# EAGLE design FOURCHANNEL REAY DRIVER (EAGLE 6.5.0)
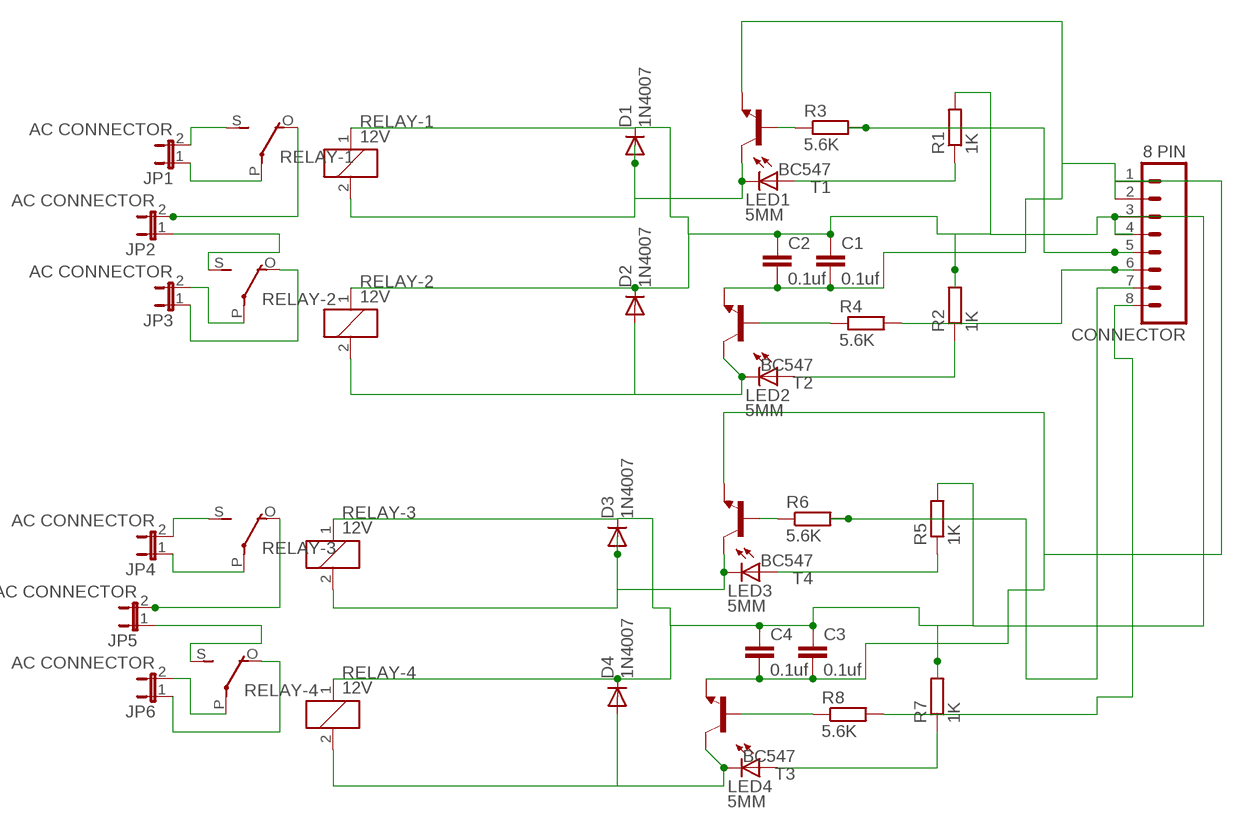
[diagram p0: schematic, sheet 1]

## Parts
C1  0.1uf  C2,5-3  [C2.5-3]
C2  0.1uf  C2,5-3  [C2.5-3]
C3  0.1uf  C2,5-3  [C2.5-3]
C4  0.1uf  C2,5-3  [C2.5-3]
CONNECTOR  8 PIN  M08  [08P]
D1  1N4007  1N4004  [DO41-10]
D2  1N4007  1N4004  [DO41-10]
D3  1N4007  1N4004  [DO41-10]
D4  1N4007  1N4004  [DO41-10]
JP1  AC CONNECTOR  JP1E  [JP1]
JP2  AC CONNECTOR  JP1E  [JP1]
JP3  AC CONNECTOR  JP1E  [JP1]
JP4  AC CONNECTOR  JP1E  [JP1]
JP5  AC CONNECTOR  JP1E  [JP1]
JP6  AC CONNECTOR  JP1E  [JP1]
LED1  5MM  LED5MM  [LED5MM]
LED2  5MM  LED5MM  [LED5MM]
LED3  5MM  LED5MM  [LED5MM]
LED4  5MM  LED5MM  [LED5MM]
R1  1K  R-EU_0204/7  [0204/7]
R2  1K  R-EU_0204/7  [0204/7]
R3  5.6K  R-EU_0204/7  [0204/7]
R4  5.6K  R-EU_0204/7  [0204/7]
R5  1K  R-EU_0204/7  [0204/7]
R6  5.6K  R-EU_0204/7  [0204/7]
R7  1K  R-EU_0204/7  [0204/7]
R8  5.6K  R-EU_0204/7  [0204/7]
RELAY-1  12V  G5L  [G5LE]
RELAY-2  12V  G5L  [G5LE]
RELAY-3  12V  G5L  [G5LE]
RELAY-4  12V  G5L  [G5LE]
T1  BC547  [TO92]
T2  BC547  [TO92]
T3  BC547  [TO92]
T4  BC547  [TO92]

## Nets
N$1: D1.A LED1.K(C) RELAY-1.2 T1.3(C)
N$3: D3.A LED3.K(C) RELAY-3.2 T4.3(C)
N$4: C1.1 C2.1 C3.1 C4.1 CONNECTOR.3 CONNECTOR.4 D1.C D2.C D3.C D4.C R1.2 R2.2 R5.2 R7.2 RELAY-1.1 RELAY-2.1 RELAY-3.1 RELAY-4.1
N$5: R4.1 T2.2(B)
N$6: R3.1 T1.2(B)
N$7: LED1.A R1.1
N$8: LED2.A R2.1
N$9: JP1.2 RELAY-1.S(2:S)
N$10: JP1.1 RELAY-1.P(2:P)
N$11: JP2.2 RELAY-1.O(2:O)
N$12: JP2.1 RELAY-2.S(2:S)
N$13: JP3.2 RELAY-2.P(2:P)
N$14: JP3.1 RELAY-2.O(2:O)
N$15: R8.1 T3.2(B)
N$17: CONNECTOR.5 R3.2
N$18: CONNECTOR.6 R4.2
N$19: R6.1 T4.2(B)
N$20: D2.A LED2.K(C) RELAY-2.2 T2.3(C)
N$21: LED3.A R5.1
N$22: LED4.A R7.1
N$23: JP4.2 RELAY-3.S(2:S)
N$24: JP4.1 RELAY-3.P(2:P)
N$25: JP5.2 RELAY-3.O(2:O)
N$26: JP5.1 RELAY-4.S(2:S)
N$27: JP6.2 RELAY-4.P(2:P)
N$28: JP6.1 RELAY-4.O(2:O)
N$29: C1.2 C2.2 C3.2 C4.2 CONNECTOR.1 CONNECTOR.2 T1.1(E) T2.1(E) T3.1(E) T4.1(E)
N$30: CONNECTOR.7 R6.2
N$31: CONNECTOR.8 R8.2
N$32: D4.A LED4.K(C) RELAY-4.2 T3.3(C)

## Library data of the parts
C1-C4 = capacitor-wima:C: CAPACITOR naming: grid - package width
CONNECTOR = con-amp-quick:M08: AMP QUICK CONNECTOR; OC_FARNELL: unknown; OC_NEWARK: unknown
D1-D4 = diode:1N4004: DIODE general purpose rectifier, 1 A
JP1-JP6 = jumper:JP1E: JUMPER
LED1-LED4 = led:LED: LED OSRAM: - CHIPLED LG R971, LG N971, LY N971, LG Q971, LY Q971, LO R971, LY R971 LH N974, LH R974 LS Q976, LO Q976, LY Q976 LO Q996 - Hyper CHIPLED LW Q18S LB Q993, LB Q99A, LB R99A - SideLED LS A670, LO A670, LY A670, LG A670, LP A670 LB A673, LV A673, LT A673, LW A673 LH A674 LY A675 LS A676, LA A676, LO A676, LY A676, LW A676 LS A679, LY A679, LG A679 - Hyper Micro SIDELED® LS Y876, LA Y876, LO Y876, LY Y876 LT Y87S - SmartLED LW L88C, LW L88S LB L89C, LB L89S, LG L890 LS L89K, LO L89K, LY L89K LS L896, LA L896, LO L896, LY L896 - TOPLED LS T670, LO T670, LY T670, LG T670, LP T670 LSG T670, LSP T670, LSY T670, LOP T670, LYG T670 LG T671, LOG T671, LSG T671 LB T673, LV T673, LT T673, LW T673 LH T674 LS T676, LA T676, LO T676, LY T676, LB T676, LH T676, LSB T676, LW T676 LB T67C, LV T67C, LT T67C, LS T67K, LO T67K, LY T67K, LW E67C LS E67B, LA E67B, LO E67B, LY E67B, LB E67C, LV E67C, LT E67C LW T67C LS T679, LY T679, LG T679 LS T770, LO T770, LY T770, LG T770, LP T770 LB T773, LV T773, LT T773, LW T773 LH T774 LS E675, LA E675, LY E675, LS T675 LS T776, LA T776, LO T776, LY T776, LB T776 LHGB T686 LT T68C, LB T68C - Hyper Mini TOPLED® LB M676 - Mini TOPLED Santana® LG M470 LS M47K, LO M47K, LY M47K Source: http://www.osram.convergy.de LUXEON: - LUMILED® LXK2-PW12-R00, LXK2-PW12-S00, LXK2-PW14-U00, LXK2-PW14-V00 LXK2-PM12-R00, LXK2-PM12-S00, LXK2-PM14-U00 LXK2-PE12-Q00, LXK2-PE12-R00, LXK2-PE12-S00, LXK2-PE14-T00, LXK2-PE14-U00 LXK2-PB12-K00, LXK2-PB12-L00, LXK2-PB12-M00, LXK2-PB14-N00, LXK2-PB14-P00, LXK2-PB14-Q00 LXK2-PR12-L00, LXK2-PR12-M00, LXK2-PR14-Q00, LXK2-PR14-R00 LXK2-PD12-Q00, LXK2-PD12-R00, LXK2-PD12-S00 LXK2-PH12-R00, LXK2-PH12-S00 LXK2-PL12-P00, LXK2-PL12-Q00, LXK2-PL12-R00 Source: www.luxeon.com KINGBRIGHT: KA-3528ASYC Source: www.kingbright.com
R1-R8 = rcl:R-EU_: RESISTOR, European symbol
RELAY-1-RELAY-4 = relay:G5L: RELAY 1 x switch, 10 A/120 V AC, 8 A/30 V ADC, Omron; OC_FARNELL: unknown; OC_NEWARK: unknown
T1-T4 = transistor:BC547: NPN TRANSISTOR

## Board
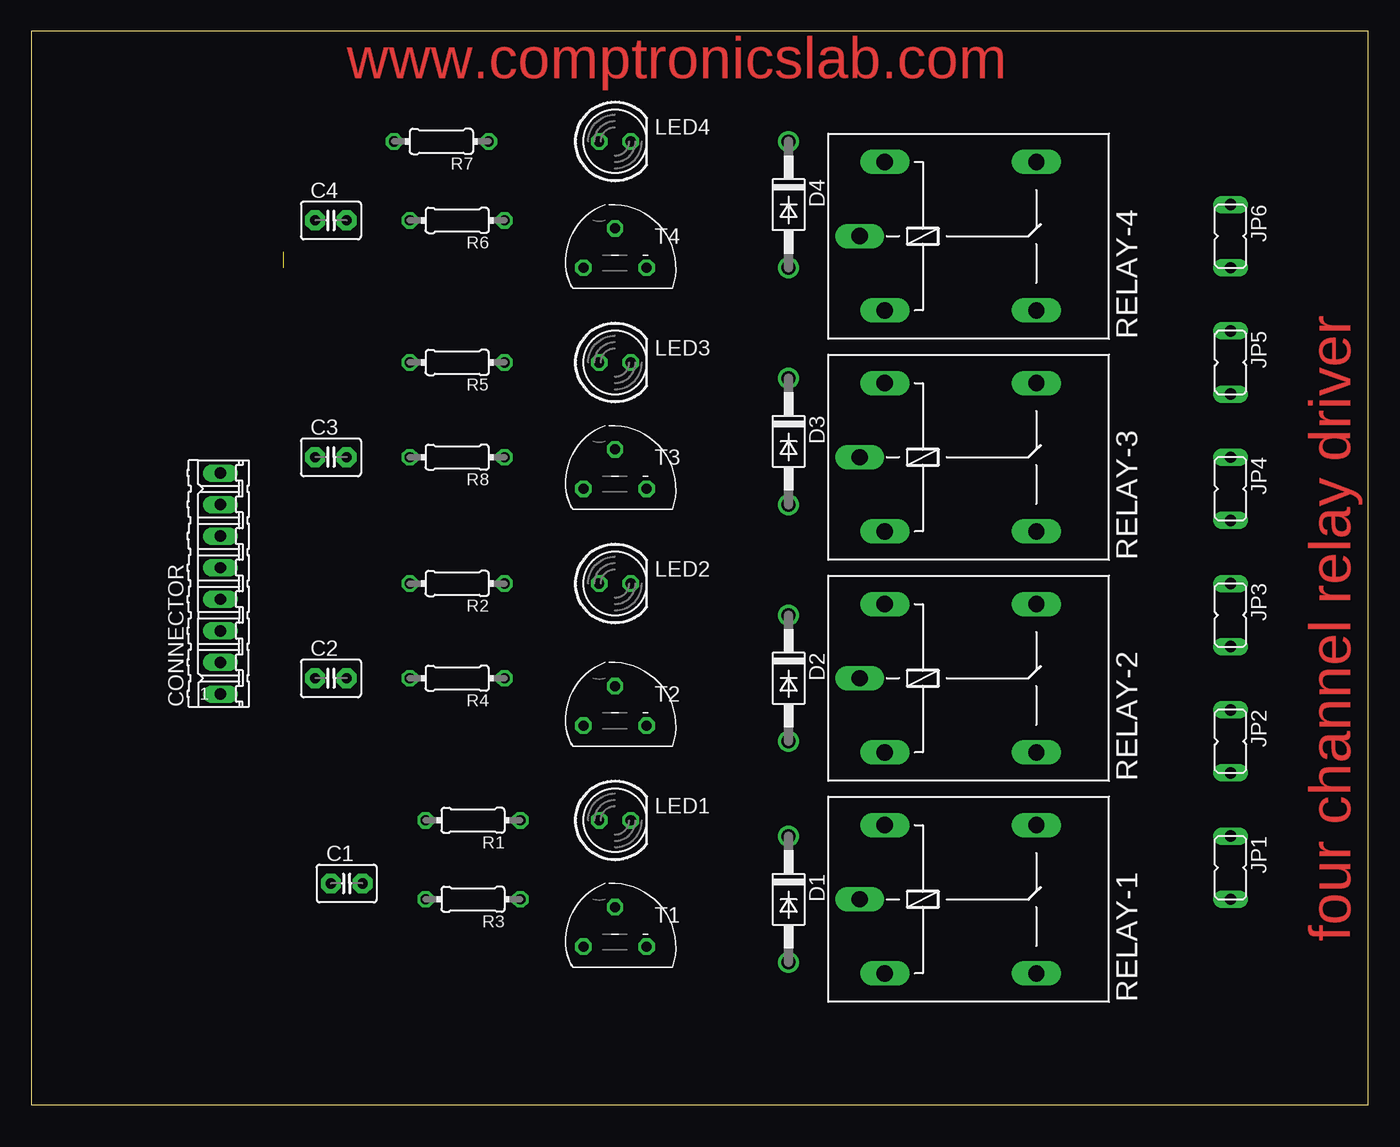
[diagram p1: board, top side]
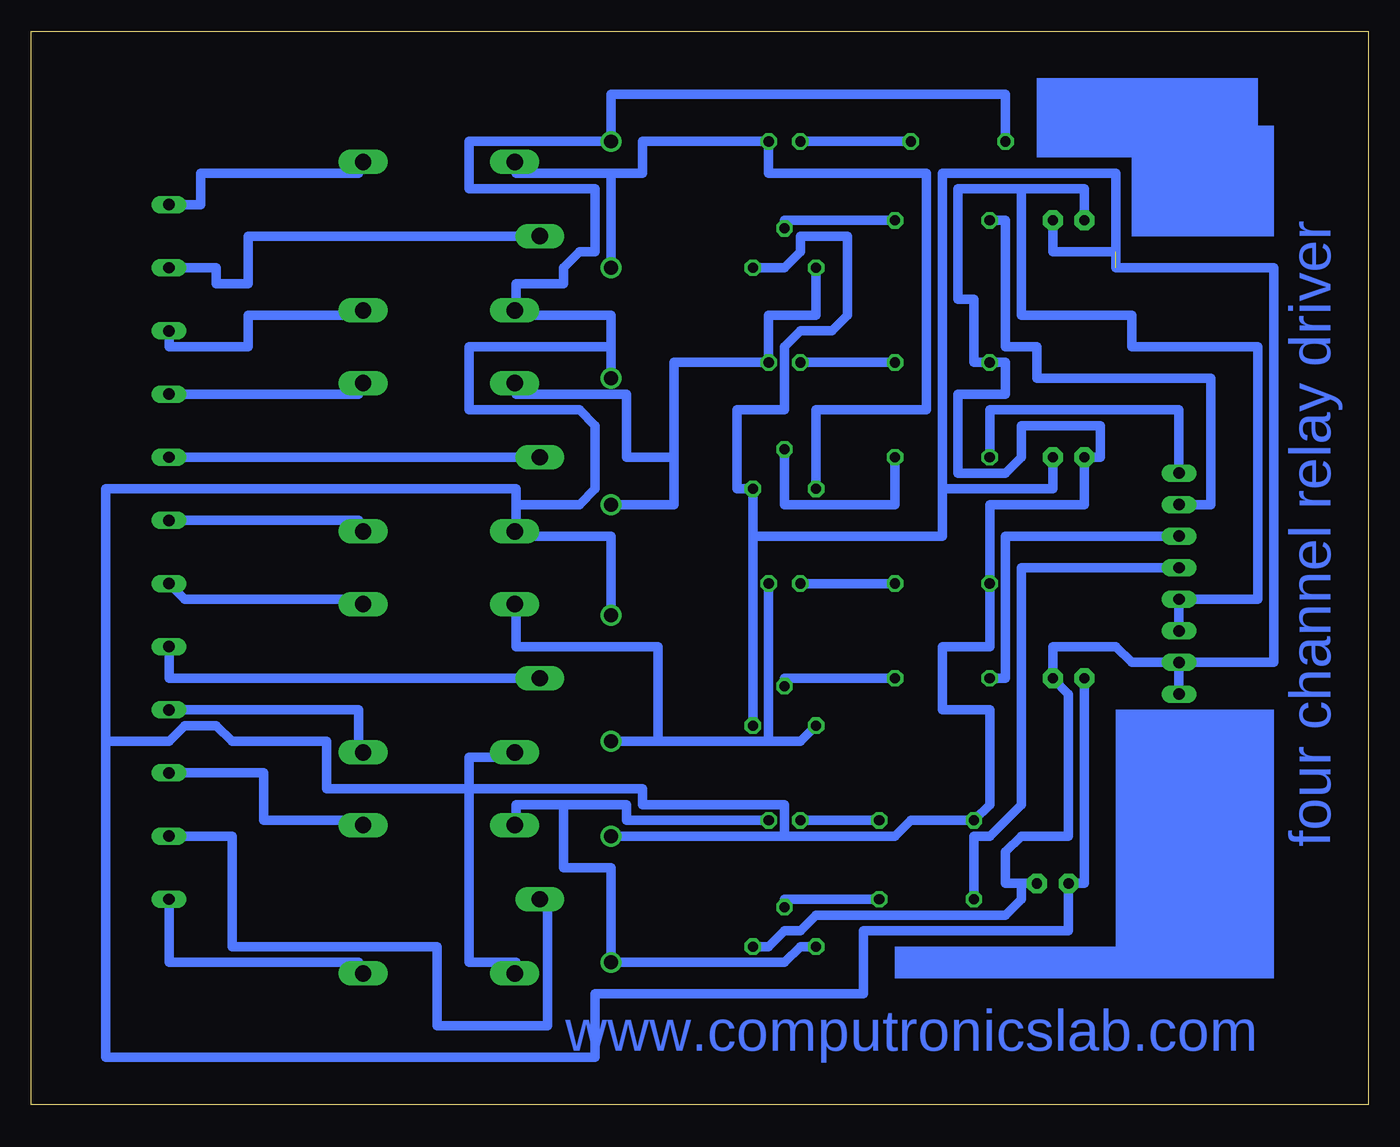
[diagram p2: board, bottom side, seen from below]

Size 107.62 x 86.35 mm. Coordinates in mm from the lower left corner, seen from the top.
Outline: 0,0 107.62,0 107.62,86.35 0,86.35 0,0
Copper layers (1*16): Top 0.035mm / dielectric 1.5mm / Bottom 0.035mm
Design rules: minimum track width 30mil, minimum drill 24mil, track to track 8mil, track to pad 8mil, pad to pad 8mil, via to via 8mil, smd to smd 8mil, copper to edge 40mil, drill to drill 8mil, minimum pad ring 10mil, minimum via ring 8mil, stop-mask expansion 4mil, vias tented up to drill 0mil, thermal gap 10mil

### Footprints (pad centres in the part's own frame; a part is rotated, then mirrored left to right if it is on the bottom)
C2.5-3 = drill 0.813 pad 1.6 octagon: 1 -1.27,0; 2 1.27,0
08P = drill 0.914 long: 1 -8.89,0; 2 -6.35,0; 3 -3.81,0; 4 -1.27,0; 5 1.27,0; 6 3.81,0; 7 6.35,0; 8 8.89,0
DO41-10 = drill 1.118: A 5.08,0; C -5.08,0
JP1 = drill 0.914 long: 1 0,-2.54; 2 0,2.54
LED5MM = drill 0.813 octagon: A -1.27,0; K 1.27,0
0204/7 = drill 0.813 octagon: 1 -3.81,0; 2 3.81,0
G5LE = drill 1.321 long: 1 -7.493,-5.969; 2 -7.493,5.969; O 4.699,5.969; P -9.525,0; S 4.699,-5.969
TO92 = drill 0.813 octagon: 1 2.54,-1.27; 2 0,1.905; 3 -2.54,-1.27

### Placement (x,y rotation side)
C1  25.4,17.78 0 top
C2  24.13,34.29 0 top
C3  24.13,52.07 0 top
C4  24.13,71.12 0 top
CONNECTOR  15.24,41.91 90 top
D1  60.96,16.51 270 top
D2  60.96,34.29 270 top
D3  60.96,53.34 270 top
D4  60.96,72.39 270 top
JP1  96.52,19.05 180 top
JP2  96.52,29.21 180 top
JP3  96.52,39.37 180 top
JP4  96.52,49.53 180 top
JP5  96.52,59.69 180 top
JP6  96.52,69.85 180 top
LED1  46.99,22.86 0 top
LED2  46.99,41.91 0 top
LED3  46.99,59.69 0 top
LED4  46.99,77.47 0 top
R1  35.56,22.86 180 top
R2  34.29,41.91 180 top
R3  35.56,16.51 180 top
R4  34.29,34.29 180 top
R5  34.29,59.69 180 top
R6  34.29,71.12 180 top
R7  33.02,77.47 180 top
R8  34.29,52.07 180 top
RELAY-1  76.2,16.51 0 top
RELAY-2  76.2,34.29 0 top
RELAY-3  76.2,52.07 0 top
RELAY-4  76.2,69.85 0 top
T1  46.99,13.97 0 top
T2  46.99,31.75 0 top
T3  46.99,50.8 0 top
T4  46.99,68.58 0 top

### Tracks (layer width: path | path; a pad name or v marks a point on that pad's centre or on a via)
N$1
  Bottom 0.762: T1.3 45.72,12.7 46.99,11.43 D1.A 60.96,19.05 64.77,19.05 64.77,24.13 | LED1.K 59.69,22.86 59.69,24.13 64.77,24.13 | RELAY-1.2 68.58,22.86 68.58,24.13 66.04,24.13 64.77,24.13
N$3
  Bottom 0.762: D3.A 55.88,48.26 55.88,52.07 | 55.88,52.07 55.88,59.69 LED3.K 48.26,63.5 44.45,63.5 T4.3 | 55.88,52.07 59.69,52.07 59.69,57.15 68.58,57.15 RELAY-3.2
N$4
  Bottom 0.762: D2.C 60.96,45.72 68.58,45.72 RELAY-3.1 68.58,46.99 68.58,48.26 | R7.2 29.21,78.74 29.21,81.28 60.96,81.28 60.96,78.74 D4.C 72.39,77.47 72.39,73.66 64.77,73.66 62.23,73.66 62.23,71.12 62.23,68.58 63.5,68.58 64.77,67.31 64.77,66.04 68.58,66.04 68.58,64.77 RELAY-4.1 68.58,63.5 60.96,63.5 D3.C 60.96,59.69 60.96,60.96 72.39,60.96 72.39,59.69 72.39,55.88 63.5,55.88 62.23,54.61 62.23,50.8 62.23,49.53 63.5,48.26 64.77,48.26 68.58,48.26 | CONNECTOR.3 CONNECTOR.4 8.89,40.64 8.89,60.96 19.05,60.96 19.05,63.5 27.94,63.5 27.94,73.66 | 27.94,73.66 33.02,73.66 33.02,64.77 31.75,64.77 31.75,59.69 R5.2 29.21,59.69 29.21,57.15 33.02,57.15 33.02,50.8 29.21,50.8 27.94,52.07 27.94,54.61 21.59,54.61 21.59,52.07 C3.1 22.86,48.26 30.48,48.26 R2.2 30.48,36.83 34.29,36.83 34.29,31.75 30.48,31.75 30.48,24.13 R1.2 36.83,22.86 38.1,21.59 46.99,21.59 | C4.1 22.86,73.66 27.94,73.66 | D1.C 46.99,21.59 | C2.1 22.86,17.78 C1.1 24.13,13.97 40.64,13.97 40.64,8.89 62.23,8.89 62.23,3.81 101.6,3.81 101.6,29.21 | 72.39,25.4 72.39,27.94 69.85,27.94 RELAY-2.1 | 72.39,25.4 72.39,11.43 68.58,11.43 68.58,10.54 RELAY-1.1 | 101.6,29.21 96.52,29.21 95.25,30.48 92.71,30.48 91.44,29.21 87.63,29.21 83.82,29.21 83.82,25.4 72.39,25.4 | 46.99,21.59 46.99,24.13 58.42,24.13 58.42,25.4 72.39,25.4 | 68.58,48.26 68.58,49.53 101.6,49.53 101.6,48.26 101.6,29.21
N$5
  Bottom 0.762: R4.1 46.99,34.29 T2.2
N$6
  Bottom 0.762: R3.1 46.99,16.51 T1.2
N$7
  Bottom 0.762: LED1.A R1.1
N$8
  Bottom 0.762: LED2.A R2.1
N$9
  Bottom 0.762: JP1.2 96.52,11.43 93.98,11.43 86.36,11.43 81.28,11.43 RELAY-1.S
N$10
  Bottom 0.762: JP1.1 91.44,21.59 91.44,12.7 74.93,12.7 74.93,6.35 66.04,6.35 66.04,16.51 RELAY-1.P
N$11
  Bottom 0.762: JP2.2 88.9,26.67 88.9,22.86 81.28,22.86 RELAY-1.O
N$12
  Bottom 0.762: JP2.1 92.71,31.75 83.82,31.75 81.28,31.75 81.28,30.48 81.28,29.21 RELAY-2.S
N$13
  Bottom 0.762: JP3.2 96.52,34.29 RELAY-2.P
N$14
  Bottom 0.762: JP3.1 95.25,40.64 81.28,40.64 RELAY-2.O
N$15
  Bottom 0.762: R8.1 38.1,48.26 45.72,48.26 46.99,48.26 46.99,49.53 T3.2
N$17
  Bottom 0.762: R3.2 31.75,21.59 30.48,21.59 27.94,24.13 27.94,43.18 CONNECTOR.5
N$18
  Bottom 0.762: R4.2 29.21,34.29 29.21,35.56 29.21,45.72 CONNECTOR.6
N$19
  Bottom 0.762: R6.1 46.99,71.12 T4.2
N$20
  Bottom 0.762: T2.3 45.72,29.21 48.26,29.21 | D2.A 57.15,29.21 | 57.15,29.21 48.26,29.21 | 48.26,29.21 LED2.K | 57.15,29.21 57.15,33.02 57.15,36.83 64.77,36.83 66.04,36.83 68.58,36.83 68.58,39.37 RELAY-2.2
N$21
  Bottom 0.762: LED3.A R5.1
N$22
  Bottom 0.762: LED4.A R7.1
N$23
  Bottom 0.762: JP4.2 81.28,46.99 RELAY-3.S
N$24
  Bottom 0.762: JP4.1 93.98,52.07 92.71,52.07 RELAY-3.P
N$25
  Bottom 0.762: JP5.2 91.44,57.15 81.28,57.15 RELAY-3.O
N$26
  Bottom 0.762: JP5.1 96.52,60.96 90.17,60.96 90.17,63.5 81.28,63.5 RELAY-4.S
N$27
  Bottom 0.762: JP6.2 92.71,67.31 92.71,66.04 90.17,66.04 90.17,69.85 RELAY-4.P
N$28
  Bottom 0.762: JP6.1 93.98,72.39 93.98,74.93 87.63,74.93 81.28,74.93 RELAY-4.O
N$29  (1 unrouted)
  Bottom 0.762: CONNECTOR.2 CONNECTOR.1 | CONNECTOR.2 19.05,35.56 20.32,36.83 25.4,36.83 C2.2 24.13,33.02 24.13,21.59 27.94,21.59 29.21,20.32 29.21,17.78 27.94,17.78 | T1.1 48.26,12.7 46.99,13.97 45.72,13.97 44.45,15.24 29.21,15.24 27.94,16.51 27.94,17.78 | C1.2 27.94,17.78 | 49.53,45.72 T3.1 50.8,49.53 50.8,55.88 46.99,55.88 46.99,60.96 45.72,62.23 43.18,62.23 41.91,63.5 41.91,68.58 41.91,69.85 43.18,69.85 45.72,69.85 45.72,68.58 46.99,67.31 T4.1 | 49.53,45.72 T2.1 | C3.2 25.4,49.53 34.29,49.53 | 34.29,49.53 34.29,45.72 49.53,45.72 | C4.2 25.4,68.58 20.32,68.58 | 34.29,49.53 34.29,74.93 20.32,74.93 20.32,67.31 7.62,67.31 7.62,35.56 CONNECTOR.2
N$30
  Bottom 0.762: R6.2 29.21,71.12 29.21,60.96 26.67,60.96 26.67,58.42 12.7,58.42 12.7,48.26 CONNECTOR.7
N$31
  Bottom 0.762: R8.2 30.48,54.61 30.48,55.88 26.67,55.88 20.32,55.88 15.24,55.88 CONNECTOR.8
N$32
  Bottom 0.762: 60.96,74.93 D4.A | 60.96,74.93 68.58,74.93 RELAY-4.2 | T3.3 44.45,55.88 35.56,55.88 35.56,74.93 48.26,74.93 LED4.K 58.42,77.47 58.42,74.93 60.96,74.93
(copper drawn outside any net)
  shapes: Bottom area x5

### Text on the board
Top: www.comptronicslab.com | four channel relay driver
Bottom: four channel relay driver | www.computronicslab.com